# EAGLE design ftdifzr (EAGLE 5.11)
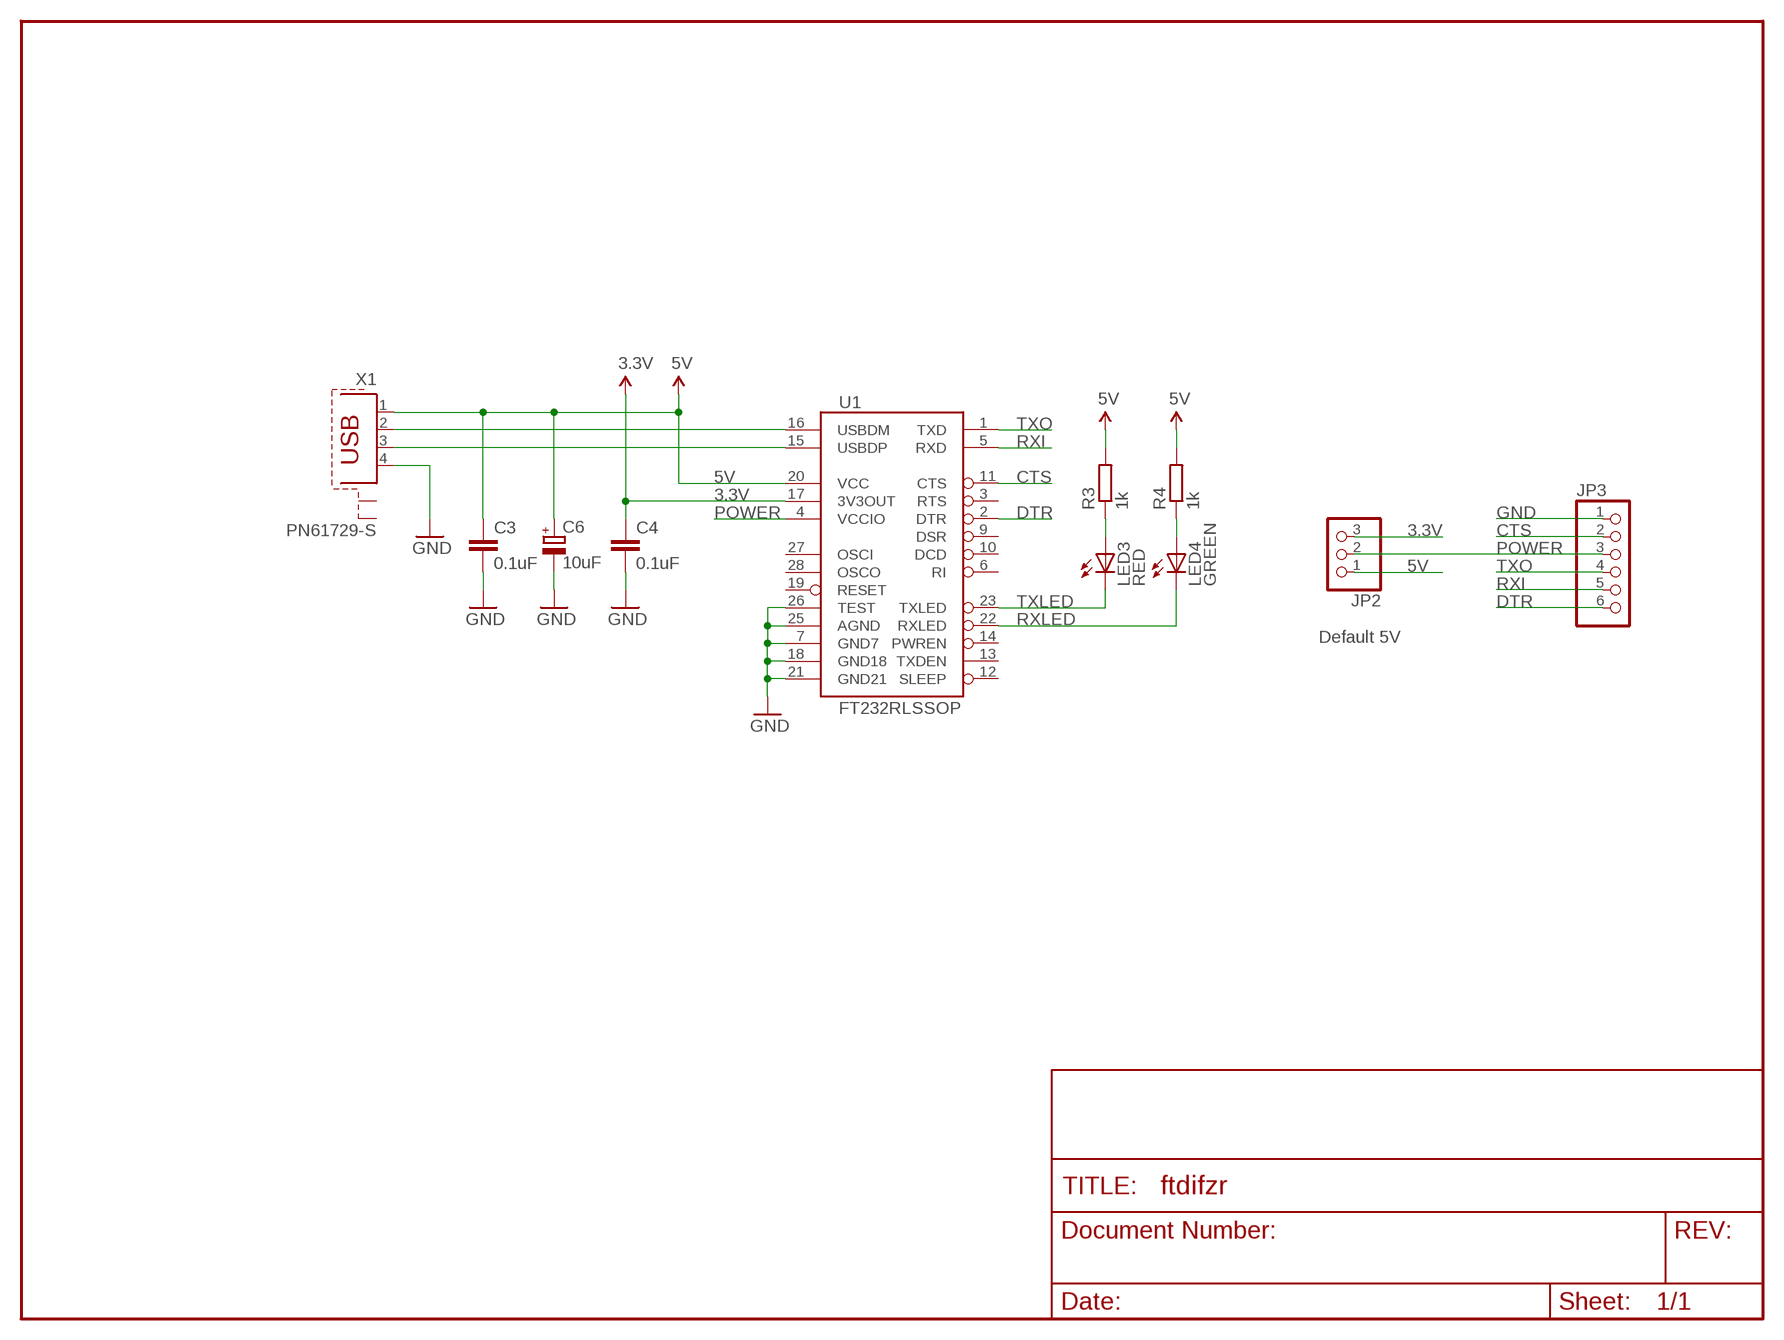
[diagram p0: schematic, sheet 1]

## Parts
C3  0.1uF  C5/2.5  [C5B2.5]
C4  0.1uF  C5/2.5  [C5B2.5]
C6  10uF  CPOL-EUE2,5-6E  [E2,5-6E]
JP2  PINHD-1X3  [1X03]
JP3  PINHD-1X6  [1X06]
LED3  RED  LED3MM  [LED3MM]
LED4  GREEN  LED3MM  [LED3MM]
R3  1k  R-EU_0204/7  [0204/7]
R4  1k  R-EU_0204/7  [0204/7]
U1  FT232RLSSOP  [SSOP28DB]
X1  PN61729-S  [PN61729-S]

## Nets
3.3V [power]: C4.1 JP2.3 U1.17(3V3OUT)
5V: C3.1 C6.+ JP2.1 R3.2 R4.2 U1.20(VCC) X1.1
CTS: JP3.2 U1.11(CTS)
DTR: JP3.6 U1.2(DTR)
GND [power]: C3.2 C4.2 C6.- JP3.1 U1.7(GND7) U1.18(GND18) U1.21(GND21) U1.25(AGND) U1.26(TEST) X1.4
N$1: LED3.A R3.1
N$2: LED4.A R4.1
POWER: JP2.2 JP3.3 U1.4(VCCIO)
RXI: JP3.5 U1.5(RXD)
RXLED: LED4.K(C) U1.22(RXLED)
TXLED: LED3.K(C) U1.23(TXLED)
TXO: JP3.4 U1.1(TXD)
USB_D+: U1.15(USBDP) X1.3
USB_D-: U1.16(USBDM) X1.2
Unconnected: U1.3(RTS) U1.6(RI) U1.9(DSR) U1.10(DCD) U1.12(SLEEP) U1.13(TXDEN) U1.14(PWREN) U1.19(RESET) U1.27(OSCI) U1.28(OSCO) X1.S1 X1.S2

## Notes on the sheet
- Default 5V

## Library data of the parts
C3 C4 = capacitor-wima:C: CAPACITOR naming: grid - package width
C6 = rcl:CPOL-EU: POLARIZED CAPACITOR, European symbol
JP2 = pinhead:PINHD-1X3: PIN HEADER
JP3 = pinhead:PINHD-1X6: PIN HEADER
LED3 LED4 = led:LED: LED OSRAM: - CHIPLED LG R971, LG N971, LY N971, LG Q971, LY Q971, LO R971, LY R971 LH N974, LH R974 LS Q976, LO Q976, LY Q976 LO Q996 - Hyper CHIPLED LW Q18S LB Q993, LB Q99A, LB R99A - SideLED LS A670, LO A670, LY A670, LG A670, LP A670 LB A673, LV A673, LT A673, LW A673 LH A674 LY A675 LS A676, LA A676, LO A676, LY A676, LW A676 LS A679, LY A679, LG A679 - Hyper Micro SIDELED® LS Y876, LA Y876, LO Y876, LY Y876 LT Y87S - SmartLED LW L88C, LW L88S LB L89C, LB L89S, LG L890 LS L89K, LO L89K, LY L89K LS L896, LA L896, LO L896, LY L896 - TOPLED LS T670, LO T670, LY T670, LG T670, LP T670 LSG T670, LSP T670, LSY T670, LOP T670, LYG T670 LG T671, LOG T671, LSG T671 LB T673, LV T673, LT T673, LW T673 LH T674 LS T676, LA T676, LO T676, LY T676, LB T676, LH T676, LSB T676, LW T676 LB T67C, LV T67C, LT T67C, LS T67K, LO T67K, LY T67K, LW E67C LS E67B, LA E67B, LO E67B, LY E67B, LB E67C, LV E67C, LT E67C LW T67C LS T679, LY T679, LG T679 LS T770, LO T770, LY T770, LG T770, LP T770 LB T773, LV T773, LT T773, LW T773 LH T774 LS E675, LA E675, LY E675, LS T675 LS T776, LA T776, LO T776, LY T776, LB T776 LHGB T686 LT T68C, LB T68C - Hyper Mini TOPLED® LB M676 - Mini TOPLED Santana® LG M470 LS M47K, LO M47K, LY M47K Source: http://www.osram.convergy.de LUXEON: - LUMILED® LXK2-PW12-R00, LXK2-PW12-S00, LXK2-PW14-U00, LXK2-PW14-V00 LXK2-PM12-R00, LXK2-PM12-S00, LXK2-PM14-U00 LXK2-PE12-Q00, LXK2-PE12-R00, LXK2-PE12-S00, LXK2-PE14-T00, LXK2-PE14-U00 LXK2-PB12-K00, LXK2-PB12-L00, LXK2-PB12-M00, LXK2-PB14-N00, LXK2-PB14-P00, LXK2-PB14-Q00 LXK2-PR12-L00, LXK2-PR12-M00, LXK2-PR14-Q00, LXK2-PR14-R00 LXK2-PD12-Q00, LXK2-PD12-R00, LXK2-PD12-S00 LXK2-PH12-R00, LXK2-PH12-S00 LXK2-PL12-P00, LXK2-PL12-Q00, LXK2-PL12-R00 Source: www.luxeon.com KINGBRIGHT: KA-3528ASYC Source: www.kingbright.com
R3 R4 = resistor:R-EU_: RESISTOR, European symbol
U1 = SparkFun:FT232RL: USB UART FT232RL 4th Generation USB UART (USB <-> Serial) Controller. Spark Fun Electronics SKU : COM-00650
X1 = con-berg:PN61729-S: BERG USB connector; OC_FARNELL: unknown; OC_NEWARK: unknown

## Net classes
0 default: width 0.203 mm
1 power: width 0.254 mm

## Board
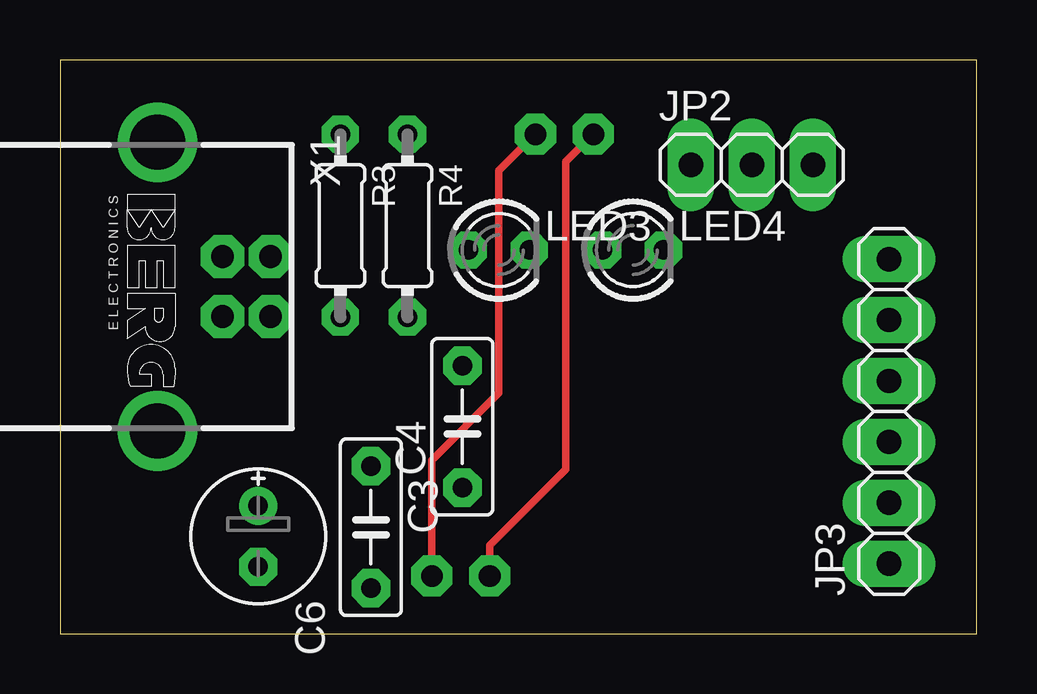
[diagram p1: board, top side]
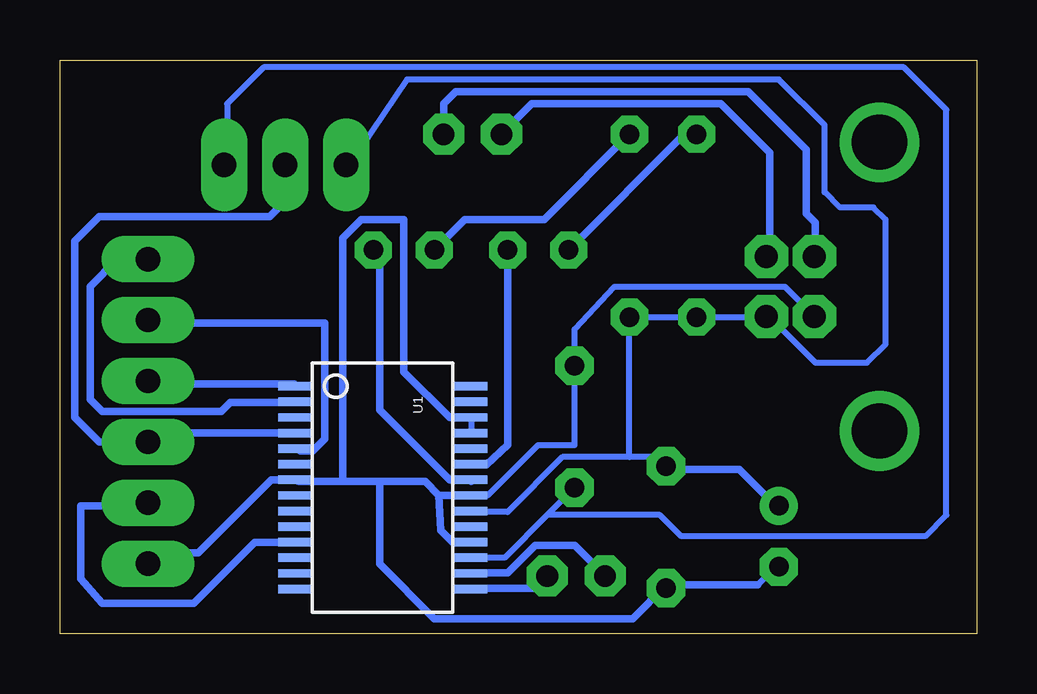
[diagram p2: board, bottom side, seen from below]

Size 38.21 x 23.93 mm. Coordinates in mm from the lower left corner, seen from the top.
Outline: 0,0 38.21,0 38.21,23.93 0,23.93 0,0
Copper layers (1*16): Top 0.035mm / dielectric 1.5mm / Bottom 0.035mm
Design rules "default *": minimum track width 12mil, minimum drill 24mil, track to track 8mil, track to pad 8mil, pad to pad 8mil, via to via 8mil, smd to smd 8mil, copper to edge 40mil, drill to drill 8mil, minimum pad ring 10mil, minimum via ring 8mil, stop-mask expansion 4mil, vias tented up to drill 0mil, thermal gap 10mil

### Footprints (pad centres in the part's own frame; a part is rotated, then mirrored left to right if it is on the bottom)
C5B2.5 = drill 0.813 pad 1.6 octagon: 1 -2.54,0; 2 2.54,0
E2,5-6E = drill 0.813 pad 1.575 round: + -1.27,0 | drill 0.813 pad 1.575 octagon: - 1.27,0
1X03 = drill 1.016 long: 1 -2.54,0; 2 0,0; 3 2.54,0
1X06 = drill 1.016 long: 1 -6.35,0; 2 -3.81,0; 3 -1.27,0; 4 1.27,0; 5 3.81,0; 6 6.35,0
LED3MM = drill 0.813 octagon: A -1.27,0; K 1.27,0
0204/7 = drill 0.813 octagon: 1 -3.81,0; 2 3.81,0
SSOP28DB = smd 0.348 x 1.397: 1 -4.225,-3.656; 2 -3.575,-3.656; 3 -2.925,-3.656; 4 -2.275,-3.656; 5 -1.625,-3.656; 6 -0.975,-3.656; 7 -0.325,-3.656; 8 0.325,-3.656; 9 0.975,-3.656; 10 1.625,-3.656; 11 2.275,-3.656; 12 2.925,-3.656; 13 3.575,-3.656; 14 4.225,-3.656; 15 4.225,3.656; 16 3.575,3.656; 17 2.925,3.656; 18 2.275,3.656; 19 1.625,3.656; 20 0.975,3.656; 21 0.325,3.656; 22 -0.325,3.656; 23 -0.975,3.656; 24 -1.625,3.656; 25 -2.275,3.656; 26 -2.925,3.656; 27 -3.575,3.656; 28 -4.225,3.656
PN61729-S = drill 0.95 octagon: 1 1.25,4.71; 2 -1.25,4.71; 3 -1.25,2.71; 4 1.25,2.71 | drill 2.3 pad 2.9 round: S1 -6.02,0; S2 6.02,0

### Placement (x,y rotation side)
C3  12.95,4.45 270 top
C4  16.76,8.64 90 top
C6  8.26,4.06 270 top
JP2  28.83,19.56 0 top
JP3  34.54,9.27 90 top
LED3  18.29,16 0 top
LED4  23.88,16 0 top
R3  11.68,17.02 270 top
R4  14.48,17.02 270 top
U1  24.77,6.1 270 bottom
X1  4.06,14.48 270 top

### Tracks (layer width: path | path; a pad name or v marks a point on that pad's centre or on a via)
3.3V
  Bottom 0.254: 17.91,4.95 C4.1 | 17.91,4.95 19.68,3.17 21.08,3.17 U1.17 | 17.91,4.95 13.21,4.95 12.32,4.06 2.16,4.06 1.27,4.95 1.27,21.84 3.05,23.62 29.72,23.62 31.24,22.1 31.24,19.56 JP2.3
5V
  Bottom 0.254: 14.48,7.37 13.21,7.37 12.95,7.11 C3.1 | 14.48,7.37 17.27,7.37 19.56,5.08 21.08,5.08 U1.20 | JP2.1 26.16,19.56 23.75,23.11 8.26,23.11 6.35,21.21 6.35,18.41 5.71,17.78 4.32,17.78 3.81,17.27 3.81,12.06 4.57,11.3 6.73,11.3 8.64,13.21 X1.1 8.89,13.21 R3.2 R4.2 14.48,7.37
  Bottom 0.305: C6.+ 8.38,5.33 9.91,6.86 12.95,6.86 C3.1
CTS
  Bottom 0.305: U1.11 28.45,3.81 30.1,3.81 32.64,1.27 36.45,1.27 37.34,2.29 37.34,5.33 34.54,5.33 JP3.2
DTR
  Bottom 0.305: JP3.6 35.81,15.62 36.96,14.48 36.96,9.78 36.45,9.27 31.5,9.27 31.11,9.65 28.45,9.65 U1.2
GND
  Bottom 0.254: 9.14,2.03 8.38,2.79 C6.- | U1.25 21.08,8.51 21.08,9.02 U1.26 | U1.21 21.14,5.78 20.38,5.78 18.29,7.87 16.76,7.87 C4.2 16.76,12.7 15.11,14.48 8,14.48 6.73,13.21 X1.4
  Bottom 0.305: 22.42,5.78 22.35,4.32 21.84,3.81 21.34,3.81 U1.18 | 22.42,5.78 21.4,5.78 U1.21 | 24.89,6.35 22.99,6.35 22.42,5.78 | 24.89,6.35 26.42,6.35 | 26.42,6.35 28.26,6.35 U1.7 28.45,6.41 29.4,6.41 32.45,3.37 34.23,3.37 34.54,3.05 JP3.1 | 26.42,6.35 26.42,16.51 25.65,17.27 23.88,17.27 23.88,10.92 21.97,9.02 21.34,9.02 U1.26 | 12.95,2.03 14.35,0.64 22.61,0.64 24.89,2.92 24.89,6.35 | 9.14,2.03 12.95,2.03 | 12.95,2.03 C3.2
N$1
  Bottom 0.305: LED3.A 12.19,20.83 R3.1
N$2
  Bottom 0.305: R4.1 18.03,17.27 21.34,17.27 LED4.A
POWER
  Bottom 0.305: U1.4 28.45,8.38 34.29,8.38 34.54,8.13 JP3.3 36.58,8 37.59,9.02 37.59,16.38 36.58,17.4 29.46,17.4 28.83,18.03 JP2.2
RXI
  Bottom 0.305: U1.5 28.19,7.62 27.69,7.62 27.18,8.13 27.18,12.95 34.54,12.95 JP3.5
RXLED
  Bottom 0.305: LED4.K 24.89,15.75 24.89,9.34 21.97,6.41 21.08,6.41 21.08,6.35 U1.22
TXLED
  Bottom 0.305: LED3.K 19.56,7.87 20.45,7.05 21.21,7.05 U1.23
TXO
  Bottom 0.305: U1.1 28.45,10.41 34.54,10.41 JP3.4
USB_D+  (via drill 0.9)
  Top 0.305: v17.91,2.41 17.91,3.68 21.08,6.86 21.08,19.68 v22.23,20.83
  Bottom 0.305: v17.91,2.41 18.29,1.91 21.08,1.91 21.21,1.91 U1.15 | v22.23,20.83 22.23,22.1 21.72,22.61 9.53,22.61 7.11,20.19 7.11,17.53 6.73,17.14 6.73,15.75 6.86,15.75 X1.3
USB_D-  (via drill 0.9)
  Top 0.305: v15.49,2.41 15.49,7.24 18.29,10.03 18.29,19.3 v19.81,20.83
  Bottom 0.305: 21.08,2.54 19.56,2.54 18.41,3.68 16.76,3.68 v15.49,2.41 | 21.08,2.54 21.34,2.54 | v19.81,20.83 18.54,22.1 10.67,22.1 8.64,20.07 8.64,15.88 | 8.64,15.88 8.76,15.75 | 21.08,2.54 U1.16 | 8.64,15.88 8.64,15.75 X1.2